# EAGLE design Main_board_TH (EAGLE 8.0.1)
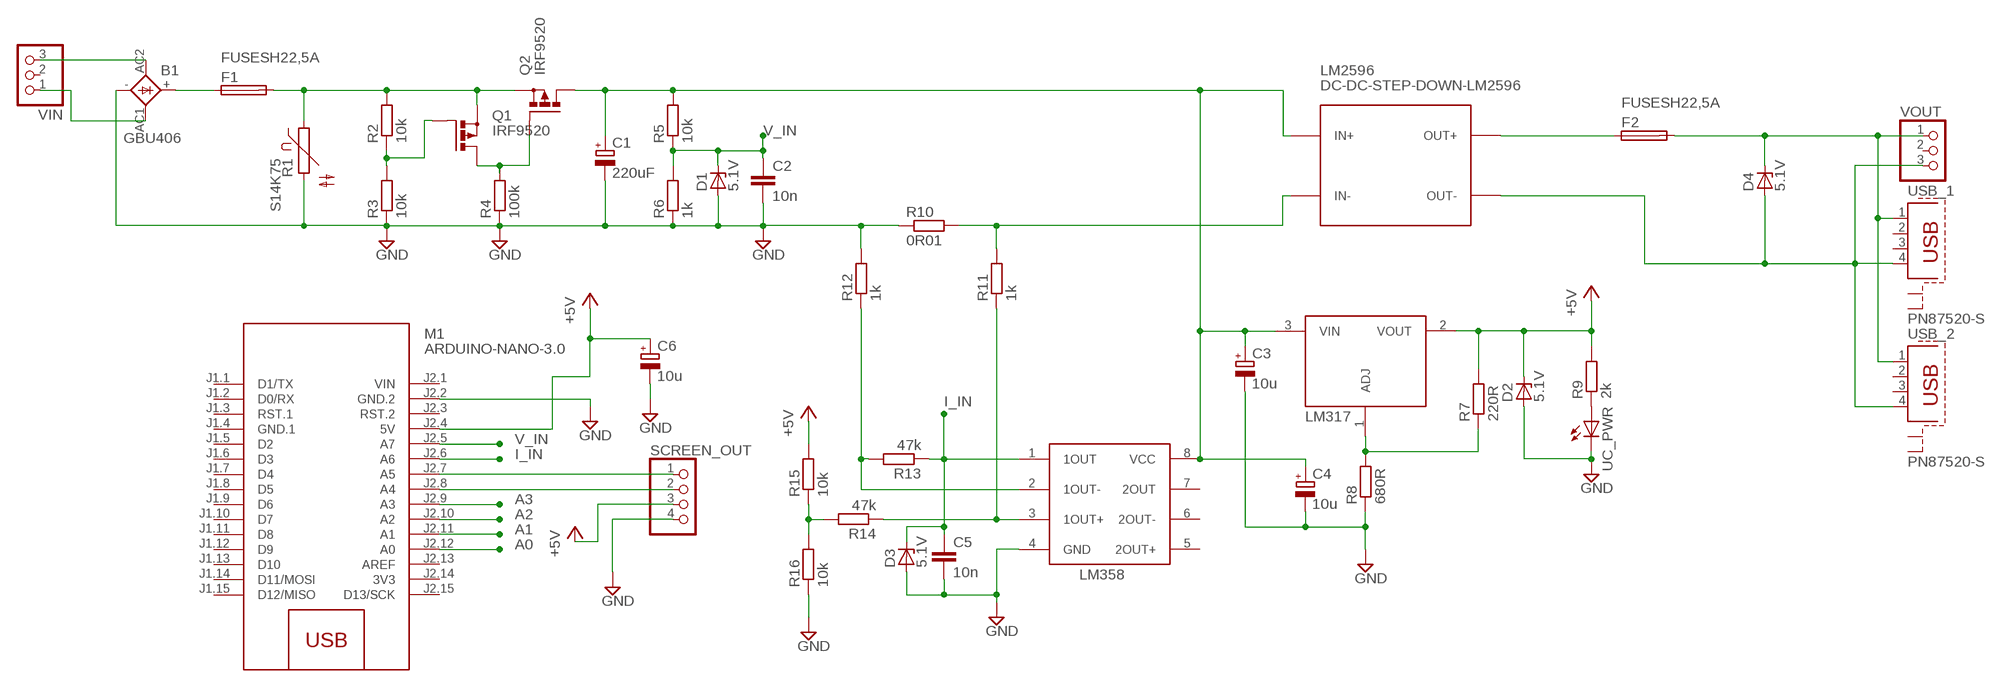
[diagram p0: schematic, sheet 1]

## Parts
B1  GBU406  GBU4  [GBU4S]
C1  220uF  CPOL-EUE3.5-10  [E3,5-10]
C2  10n  C-EU050-024X044  [C050-024X044]
C3  10u  CPOL-EUE2.5-7  [E2,5-7]
C4  10u  CPOL-EUE2.5-7  [E2,5-7]
C5  10n  C-EU050-024X044  [C050-024X044]
C6  10u  CPOL-EUE2.5-7  [E2,5-7]
D1  5.1V  ZPD  [DO35Z10]
D2  5.1V  ZPD  [DO35Z10]
D3  5.1V  ZPD  [DO35Z10]
D4  5.1V  ZPD  [DO35Z10]
F1  FUSESH22,5A  [SH22,5A]
F2  FUSESH22,5A  [SH22,5A]
LM317  LM317  [TO220BV]
LM358  LM358  [DIL08]
LM2596  DC-DC-STEP-DOWN-LM2596  [DC-DC-STEP-DOWN-LM2596]
M1  ARDUINO-NANO-3.0  [ARDUINO-NANO-3.0]
Q1  IRF9520  PMOSFET_PTO220BV  [TO220BV]
Q2  IRF9520  PMOSFET_PTO220BV  [TO220BV]
R1  S14K75  S14K17  [S14K17]
R2  10k  R-EU_0207/10  [0207/10]
R3  10k  R-EU_0207/10  [0207/10]
R4  100k  R-EU_0207/10  [0207/10]
R5  10k  R-EU_0207/10  [0207/10]
R6  1k  R-EU_0207/10  [0207/10]
R7  220R  R-EU_0207/10  [0207/10]
R8  680R  R-EU_0207/10  [0207/10]
R9  2k  R-EU_0207/10  [0207/10]
R10  0R01  R-EU_0207/15  [0207/15]
R11  1k  R-EU_0207/10  [0207/10]
R12  1k  R-EU_0207/10  [0207/10]
R13  47k  R-EU_0207/10  [0207/10]
R14  47k  R-EU_0207/10  [0207/10]
R15  10k  R-EU_0207/10  [0207/10]
R16  10k  R-EU_0207/10  [0207/10]
SCREEN_OUT  PINHD-1X4  [1X04]
UC_PWR  LED3MM  [LED3MM]
USB_1  PN87520-S  [PN87520-S]
USB_2  PN87520-S  [PN87520-S]
VIN  PINHD-1X3  [1X03]
VOUT  PINHD-1X3  [1X03]

## Nets
+5V: C6.+ D2.C LM317.2(VOUT) M1.J2.4(5V) R7.2 R9.2 R15.2 SCREEN_OUT.3
A0: M1.J2.12(A0)
A1: M1.J2.11(A1)
A2: M1.J2.10(A2)
A3: M1.J2.9(A3)
A4: M1.J2.8(A4) SCREEN_OUT.2
A5: M1.J2.7(A5) SCREEN_OUT.1
GND: B1.- C1.- C2.2 C3.- C4.- C5.2 C6.- D1.A D2.A D3.A LM358.4(GND) M1.J2.2(GND.2) R1.2 R3.1 R4.1 R6.1 R8.1 R10.1 R12.2 R16.1 SCREEN_OUT.4 UC_PWR.K(C)
I_IN: C5.1 D3.C LM358.1(1OUT) M1.J2.6(A6) R13.1
N$1: B1.+ F1.1
N$2: R9.1 UC_PWR.A
N$3: Q1.1(G) R2.1 R3.2
N$4: LM2596.IN- R10.2 R11.2
N$5: LM358.3(1OUT+) R11.1 R14.1
N$6: LM358.2(1OUT-) R12.1 R13.2
N$7: B1.AC1(AC2) VIN.1
N$8: R14.2 R15.1 R16.2
N$9: B1.AC2(AC1) VIN.3
N$10: D4.A LM2596.OUT- USB_1.4 USB_2.4 VOUT.3
N$23: LM317.1(ADJ) R7.1 R8.2
Q2_GATE: Q1.2(D) Q2.1(G) R4.2
V_IN: C2.1 D1.C M1.J2.5(A7) R5.1 R6.2
VIN_PROTECTED: C1.+ C3.+ C4.+ LM317.3(VIN) LM358.8(VCC) LM2596.IN+ Q2.2(D) R5.2
VIN_UNPROTECTED: F1.2 Q1.3(S) Q2.3(S) R1.1 R2.2
VOUT_FINAL: D4.C F2.2 USB_1.1 USB_2.1 VOUT.1
VOUT_PREFUSE: F2.1 LM2596.OUT+
Unconnected: LM358.5(2OUT+) LM358.6(2OUT-) LM358.7(2OUT) M1.J1.1(D1/TX) M1.J1.2(D0/RX) M1.J1.3(RST.1) M1.J1.5(D2) M1.J1.6(D3) M1.J1.7(D4) M1.J1.8(D5) M1.J1.9(D6) M1.J1.10(D7) M1.J1.11(D8) M1.J1.12(D9) M1.J1.13(D10) M1.J1.14(D11/MOSI) M1.J1.15(D12/MISO) M1.J2.3(RST.2) M1.J2.13(AREF) M1.J2.15(D13/SCK) USB_1.2 USB_1.3 USB_1.S1 USB_1.S2 USB_2.2 USB_2.3 USB_2.S1 USB_2.S2 VIN.2 VOUT.2

## Power pins joined to a net without a drawn wire
3V3: M1.J2.14(3V3)
GND.1: M1.J1.4(GND.1)
VIN: M1.J2.1(VIN)

## Library data of the parts
B1 = rectifier:GBU4: GENERAL INSTRUMENT RECTIFIER
C1 C3 C4 C6 = resistor:CPOL-EU: POLARIZED CAPACITOR, European symbol
C2 C5 = resistor:C-EU: CAPACITOR, European symbol
D1-D4 = diode:ZPD: Z DIODE 500 mW
F1 F2 = fuse:FUSE: Fuse; OC_FARNELL: unknown; OC_NEWARK: unknown
LM317 = Samson:LM317
LM358 = Samson:LM358
LM2596 = diy-modules:DC-DC-STEP-DOWN-LM2596: DC/DC Step-Down Regulator based on LM2596-ADJ chip LM2596 datasheet available here: http://www.ti.com/lit/ds/symlink/lm2596.pdf Click here to find device on ebay.com <http://www.ebay.com/sch/lm2596+power+regulator>
M1 = diy-modules:ARDUINO-NANO-3.0: Arduino Nano 3.0 and compatible devices More details available here: https://www.arduino.cc/en/Main/ArduinoBoardNano Click here to find device on ebay.com <http://www.ebay.com/sch/arduino+nano>
Q1 Q2 = Samson:PMOSFET_P: Power MOSFET P-Channel
R1 = varistor:S14K17: VARISTOR
R2-R16 = resistor:R-EU_: RESISTOR, European symbol
SCREEN_OUT = pinhead:PINHD-1X4: PIN HEADER
UC_PWR = led:LED: LED OSRAM: - CHIPLED LG R971, LG N971, LY N971, LG Q971, LY Q971, LO R971, LY R971 LH N974, LH R974 LS Q976, LO Q976, LY Q976 LO Q996 - Hyper CHIPLED LW Q18S LB Q993, LB Q99A, LB R99A - SideLED LS A670, LO A670, LY A670, LG A670, LP A670 LB A673, LV A673, LT A673, LW A673 LH A674 LY A675 LS A676, LA A676, LO A676, LY A676, LW A676 LS A679, LY A679, LG A679 - Hyper Micro SIDELED® LS Y876, LA Y876, LO Y876, LY Y876 LT Y87S - SmartLED LW L88C, LW L88S LB L89C, LB L89S, LG L890 LS L89K, LO L89K, LY L89K LS L896, LA L896, LO L896, LY L896 - TOPLED LS T670, LO T670, LY T670, LG T670, LP T670 LSG T670, LSP T670, LSY T670, LOP T670, LYG T670 LG T671, LOG T671, LSG T671 LB T673, LV T673, LT T673, LW T673 LH T674 LS T676, LA T676, LO T676, LY T676, LB T676, LH T676, LSB T676, LW T676 LB T67C, LV T67C, LT T67C, LS T67K, LO T67K, LY T67K, LW E67C LS E67B, LA E67B, LO E67B, LY E67B, LB E67C, LV E67C, LT E67C LW T67C LS T679, LY T679, LG T679 LS T770, LO T770, LY T770, LG T770, LP T770 LB T773, LV T773, LT T773, LW T773 LH T774 LS E675, LA E675, LY E675, LS T675 LS T776, LA T776, LO T776, LY T776, LB T776 LHGB T686 LT T68C, LB T68C - Hyper Mini TOPLED® LB M676 - Mini TOPLED Santana® LG M470 LS M47K, LO M47K, LY M47K Source: http://www.osram.convergy.de LUXEON: - LUMILED® LXK2-PW12-R00, LXK2-PW12-S00, LXK2-PW14-U00, LXK2-PW14-V00 LXK2-PM12-R00, LXK2-PM12-S00, LXK2-PM14-U00 LXK2-PE12-Q00, LXK2-PE12-R00, LXK2-PE12-S00, LXK2-PE14-T00, LXK2-PE14-U00 LXK2-PB12-K00, LXK2-PB12-L00, LXK2-PB12-M00, LXK2-PB14-N00, LXK2-PB14-P00, LXK2-PB14-Q00 LXK2-PR12-L00, LXK2-PR12-M00, LXK2-PR14-Q00, LXK2-PR14-R00 LXK2-PD12-Q00, LXK2-PD12-R00, LXK2-PD12-S00 LXK2-PH12-R00, LXK2-PH12-S00 LXK2-PL12-P00, LXK2-PL12-Q00, LXK2-PL12-R00 Source: www.luxeon.com KINGBRIGHT: KA-3528ASYC Source: www.kingbright.com
USB_1 USB_2 = con-berg:PN87520-S; OC_FARNELL: unknown; OC_NEWARK: unknown
VIN VOUT = pinhead:PINHD-1X3: PIN HEADER

## Module BB1
Ports: 

### Library data of the parts

## Board
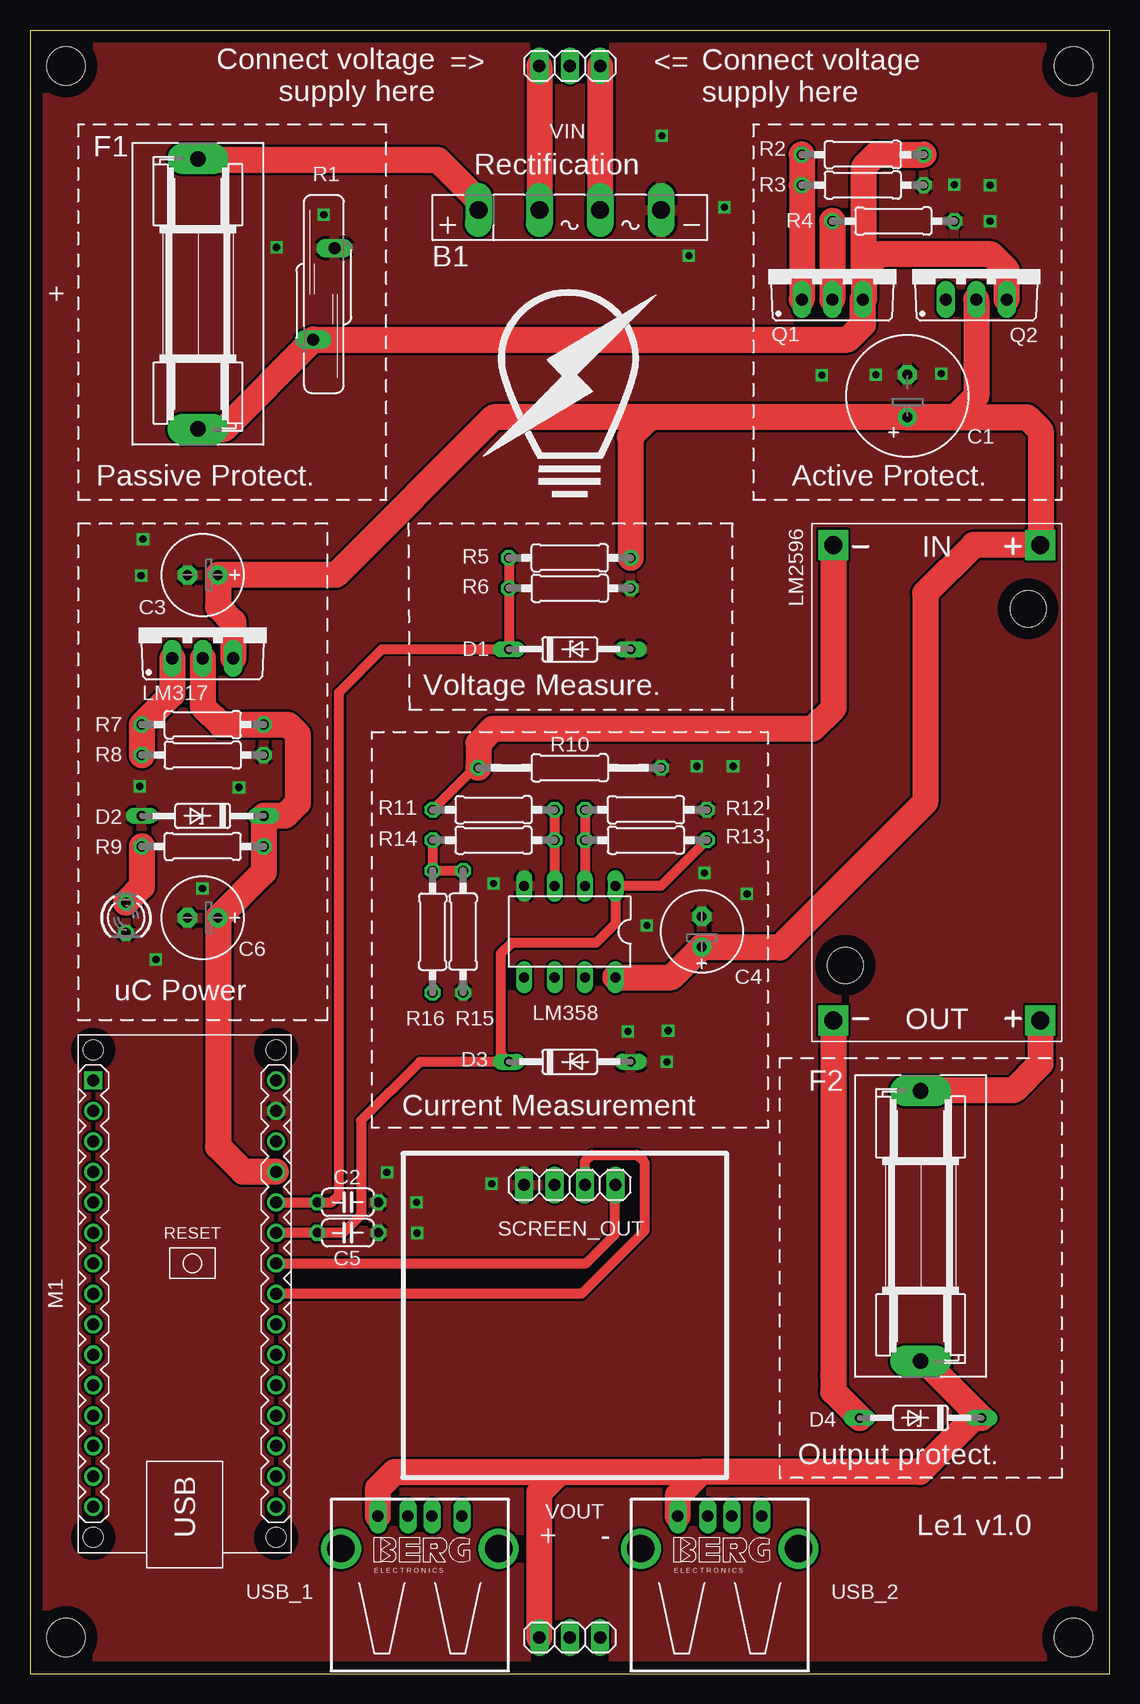
[diagram p1: board, top side]
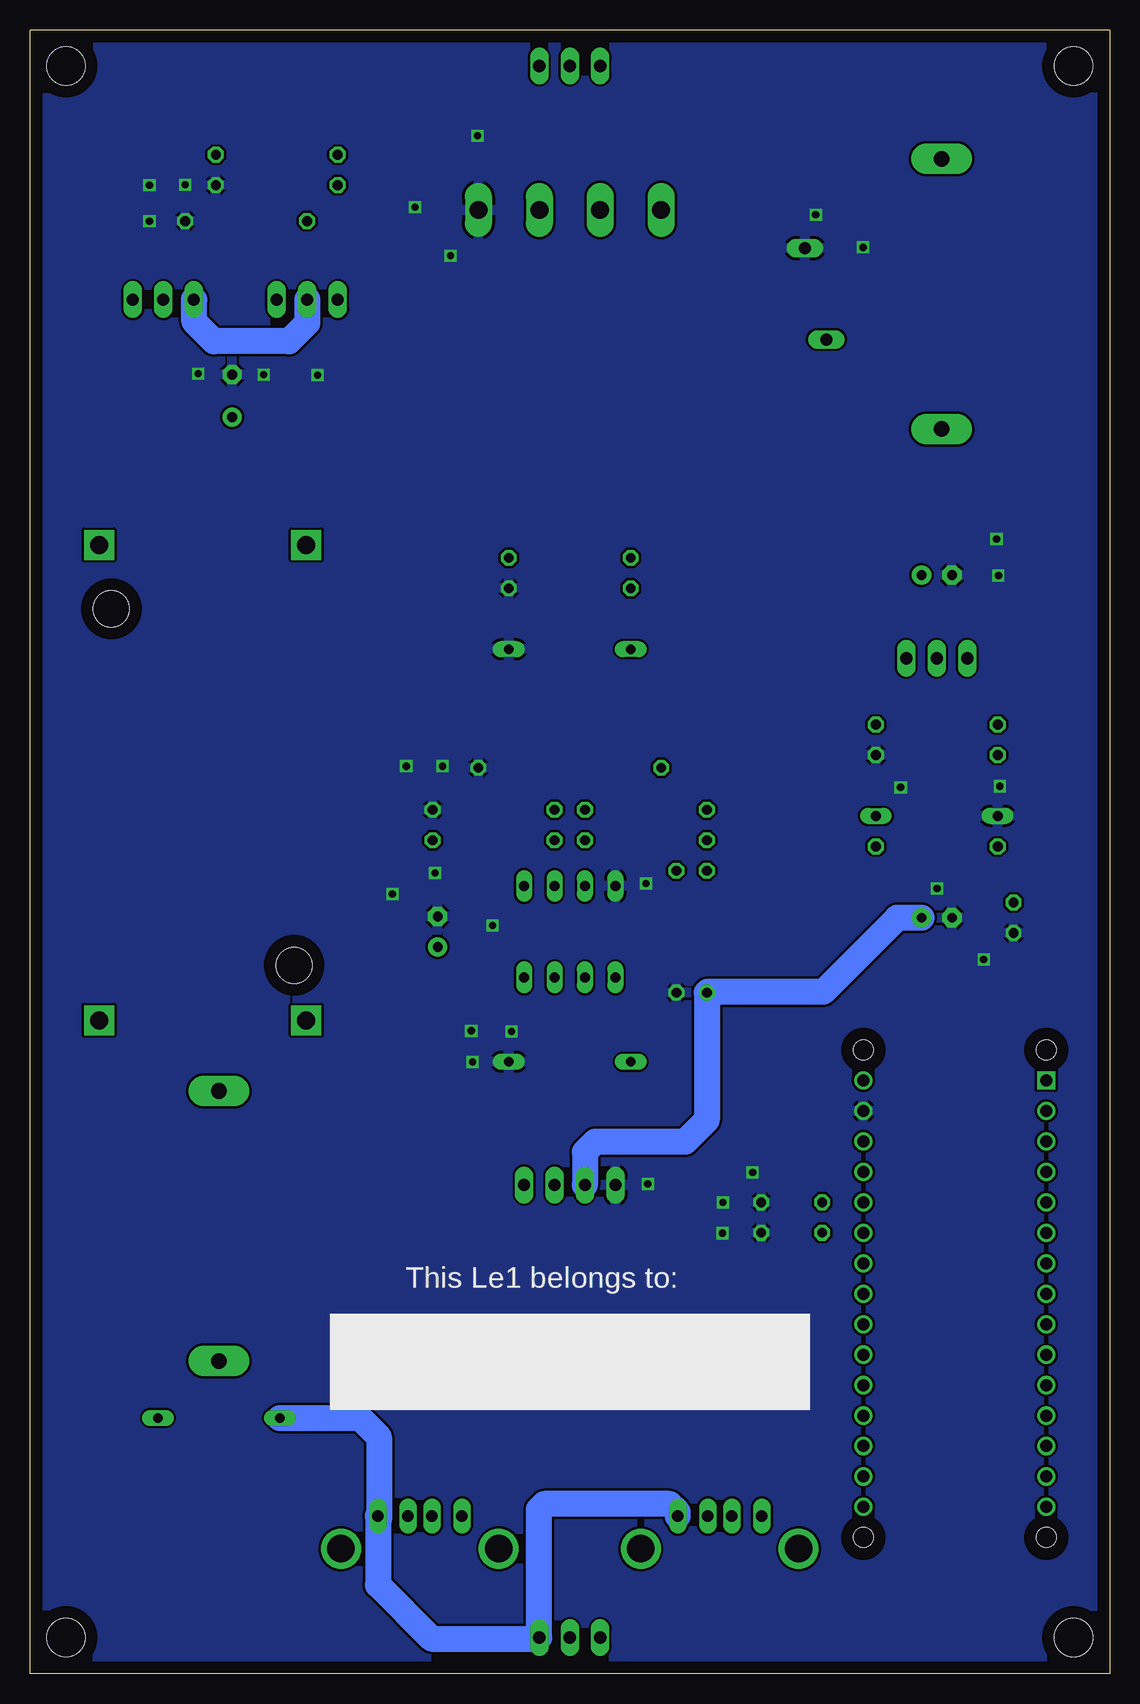
[diagram p2: board, bottom side, seen from below]

Size 90 x 137 mm. Coordinates in mm from the lower left corner, seen from the top.
Outline: 0,137 0,0 90,0 90,137 0,137
Copper layers (1*16): Top 0.035mm / dielectric 1.5mm / Bottom 0.035mm
Design rules "default *": minimum track width 10mil, minimum drill 20mil, track to track 8mil, track to pad 8mil, pad to pad 8mil, via to via 8mil, smd to smd 8mil, copper to edge 40mil, drill to drill 8mil, minimum pad ring 10mil, minimum via ring 8mil, stop-mask expansion 4mil, vias tented up to drill 0mil, thermal gap 10mil
Holes 3.2 mm at 87,134 87,3 3,3 3,134

### Footprints (pad centres in the part's own frame; a part is rotated, then mirrored left to right if it is on the bottom)
GBU4S = drill 1.499 long: + 7.62,0; - -7.62,0; AC1 2.54,0; AC2 -2.54,0
E3,5-10 = drill 0.813 pad 1.6: + -1.778,0 | drill 0.813 pad 1.6 octagon: - 1.778,0
C050-024X044 = drill 0.813 octagon: 1 -2.54,0; 2 2.54,0
E2,5-7 = drill 0.813 pad 1.6: + -1.27,0 | drill 0.813 pad 1.6 octagon: - 1.27,0
DO35Z10 = drill 0.813 long: A 5.08,0; C -5.08,0
SH22,5A = drill 1.321 pad 2.54 long: 1 -11.252,0; 2 11.252,0
TO220BV = drill 1.016 long: 1 -2.54,-2.54; 2 0,-2.54; 3 2.54,-2.54
DIL08 = drill 0.813 long: 1 -3.81,-3.81; 2 -1.27,-3.81; 3 1.27,-3.81; 4 3.81,-3.81; 5 3.81,3.81; 6 1.27,3.81; 7 -1.27,3.81; 8 -3.81,3.81
DC-DC-STEP-DOWN-LM2596 = drill 1.5 pad 2.5 square: IN+ -19.812,8.636; IN- -19.812,-8.636; OUT+ 19.812,8.636; OUT- 19.812,-8.636 | hole 3: -14.478,7.62; 15.24,-7.62
ARDUINO-NANO-3.0 = drill 1 square: J1.1 17.78,7.62 | drill 1: J1.2 15.24,7.62; J1.3 12.7,7.62; J1.4 10.16,7.62; J1.5 7.62,7.62; J1.6 5.08,7.62; J1.7 2.54,7.62; J1.8 0,7.62; J1.9 -2.54,7.62; J1.10 -5.08,7.62; J1.11 -7.62,7.62; J1.12 -10.16,7.62; J1.13 -12.7,7.62; J1.14 -15.24,7.62; J1.15 -17.78,7.62; J2.1 17.78,-7.62; J2.2 15.24,-7.62; J2.3 12.7,-7.62; J2.4 10.16,-7.62; J2.5 7.62,-7.62; J2.6 5.08,-7.62; J2.7 2.54,-7.62; J2.8 0,-7.62; J2.9 -2.54,-7.62; J2.10 -5.08,-7.62; J2.11 -7.62,-7.62; J2.12 -10.16,-7.62; J2.13 -12.7,-7.62; J2.14 -15.24,-7.62; J2.15 -17.78,-7.62 | hole 1.651: -20.32,7.62; -20.32,-7.62; 20.32,-7.62; 20.32,7.62
S14K17 = drill 1.016 long: 1 -0.889,-3.81; 2 0.889,3.81
0207/10 = drill 0.813 octagon: 1 -5.08,0; 2 5.08,0
0207/15 = drill 0.813 octagon: 1 -7.62,0; 2 7.62,0
1X04 = drill 1.016 long: 1 -3.81,0; 2 -1.27,0; 3 1.27,0; 4 3.81,0
LED3MM = drill 0.813 octagon: A -1.27,0; K 1.27,0
PN87520-S = drill 0.95 long: 1 -3.5,2.71; 2 -1,2.71; 3 1,2.71; 4 3.5,2.71 | drill 2.3 pad 2.9: S1 -6.57,0; S2 6.57,0
1X03 = drill 1.016 long: 1 -2.54,0; 2 0,0; 3 2.54,0

### Placement (x,y rotation side)
B1  45,122 180 top
C1  73.15,106.5 90 top
C2  26.5,39.28 0 top
C3  14.4,91.57 180 top
C4  56.01,61.84 90 top
C5  26.5,36.74 0 top
C6  14.4,63 180 top
D1  45,85.38 0 top
D2  14.4,71.48 180 top
D3  45,51 0 top
D4  74.25,21.3 180 top
F1  14,115 270 top
F2  74.25,37.3 270 top
LM317  14.4,87.17 0 top
LM358  45,61.84 180 top
LM2596  75.6,74.27 270 top
M1  12.9,31.66 90 top
Q1  66.89,117.07 0 top
Q2  78.89,117.07 0 top
R1  24.5,115 0 top
R2  69.43,126.61 0 top
R3  69.43,124.07 180 top
R4  71.98,121.07 180 top
R5  45,93 0 top
R6  45,90.46 180 top
R7  14.4,79.1 0 top
R8  14.4,76.56 180 top
R9  14.4,68.94 0 top
R10  45,75.5 180 top
R11  38.65,72 180 top
R12  51.35,72 0 top
R13  51.35,69.46 180 top
R14  38.65,69.46 180 top
R15  33.57,61.84 270 top
R16  36.11,61.84 90 top
SCREEN_OUT  45,40.72 180 top
UC_PWR  8,63 270 top
USB_1  32.5,10.4 0 top
USB_2  57.5,10.4 0 top
VIN  45,134 0 top
VOUT  45,3 0 top

### Tracks (layer width: path | path; a pad name or v marks a point on that pad's centre or on a via)
+5V
  Top 2.184: LM317.2 14.4,80.61 15.92,79.09 R7.2 21.52,79.1 22.32,78.3 22.32,72.55 21.25,71.48 D2.C R9.2 19.48,66.81 C6.+ 15.67,43.93 17.76,41.84 20.52,41.84 M1.J2.4
  Bottom 2.184: C6.+ 17.69,63 23.87,56.82 33.51,56.82 R15.2 33.57,46.14 35.39,44.32 42.89,44.32 43.75,43.46 43.75,40.74 SCREEN_OUT.3
A4
  Top 0.813: SCREEN_OUT.2 46.27,42.68 46.84,43.25 50.59,43.25 51.21,42.63 51.21,36.89 45.98,31.66 M1.J2.8
A5
  Top 0.813: M1.J2.7 46.36,34.2 48.76,36.6 48.76,40.67 SCREEN_OUT.1
GND  (via drill 0.6)
  other vias: 57.9,122.23 80.04,124.06 80.04,121.07 32.23,39.27 29.76,41.78 52.68,128.19 77.07,124.11 32.27,36.71 38.5,40.8 20.55,118.88 54.95,118.18 24.5,121.6 53.12,50.99 49.85,53.53 53.21,53.58 10.5,59.53 14.38,65.43 59.79,64.97 56.23,66.72 51.43,62.35 38.64,65.85 9.26,91.52 9.42,94.55 70.53,108.27 66.02,108.23 75.99,108.36 55.62,75.63 58.63,75.63 9.15,73.96 17.42,73.87
  pour Bottom: 90.83,137.52 91.25,-2.02 -1.44,-2.02 -1.86,6.38 -2.32,6.38 -2.32,137.74 0.52,137.74
  pour Top: 90.77,137.92 91.4,-2.26 -1.84,-2.26 -2.47,137.93
I_IN
  Top 0.813: R13.1 52.62,65.65 LM358.1 48.81,62.54 47.18,60.91 40.14,60.91 39.24,60.01 39.24,51.68 D3.C 32.5,51 27.59,46.09 27.59,38.22 26.09,36.72 23.98,36.72 C5.1 | C5.1 24.67,36.73 | C5.1 M1.J2.6
N$1
  Top 2.184: B1.+ 37.38,122.79 34.01,126.16 13.59,126.16 F1.1
N$2
  Top 2.184: R9.1 9.32,65.59 UC_PWR.A
N$3
  Top 2.184: R2.1 R3.2 Q1.1
N$4
  Top 0.813: R10.2 37.07,75.5 R11.2
  Top 2.184: R10.2 37.38,77.54 38.6,78.76 65.26,78.76 67,80.5 67,94.05 LM2596.IN-
N$5
  Top 0.813: R11.1 R14.1 LM358.3
N$6
  Top 0.813: LM358.2 R13.2 R12.1
N$7
  Top 2.184: VIN.1 B1.AC1
N$8
  Top 0.813: R14.2 R15.1 R16.2
N$9
  Top 2.184: VIN.3 B1.AC2
N$10
  Top 2.184: LM2596.OUT- 66.96,24.86 | 66.98,24.84 66.96,24.86 | 66.96,24.86 66.96,23.51 D4.A
  Bottom 2.184: USB_1.4 36,13.46 36.67,14.13 47.11,14.13 47.59,13.65 47.59,3.05 VOUT.3 47.64,2.9 56.52,2.9 61,7.38 USB_2.4 60.9,12.81 60.9,19.72 62.48,21.3 D4.A
N$23
  Top 2.184: LM317.1 11.86,81.64 R7.1 R8.2
Q2_GATE
  Top 2.184: R4.2 Q1.2
  Bottom 2.184: Q1.2 66.89,112.57 68.4,111.06 74.67,111.06 76.31,112.7 76.31,114.49 Q2.1
V_IN
  Top 0.813: R5.1 R6.2 D1.C 29.35,85.38 25.75,81.78 25.75,39.87 25.16,39.28 C2.1 M1.J2.5
VIN_PROTECTED
  Top 2.184: Q2.2 78.89,106.47 77.14,104.72 C1.+ | C1.+ 83.14,104.72 84.26,103.6 84.26,94.11 LM2596.IN+ 78.67,94.08 74.64,90.05 74.64,72.63 62.52,60.51 56.07,60.51 C4.+ 53.47,58.03 LM358.8 | C1.+ 51.67,104.72 | 50.05,103.1 51.67,104.72 | 50.05,103.1 50.05,93.03 R5.2 | 50,103.05 50.05,103.1 | LM317.3 16.94,87.66 15.67,88.93 C3.+ 25.5,91.57 38.65,104.72 51.67,104.72
VIN_UNPROTECTED
  Top 2.184: R2.2 70.54,126.61 69.53,125.6 69.53,117.04 | 69.53,117.04 69.53,114.63 Q1.3 69.44,112.45 68.18,111.19 R1.1 16.17,103.75 F1.2 | Q2.3 81.43,117.02 80.14,118.31 70.8,118.31 69.53,117.04
VOUT_FINAL
  Top 2.184: 44.17,16.8 55.97,16.8 | 44.17,16.8 30.38,16.8 29,15.42 USB_1.1 | USB_2.1 54,14.83 55.97,16.8 | VOUT.1 42.46,15.09 44.17,16.8 | 55.97,16.8 74.18,16.8 78.68,21.3 D4.C 74.58,26.05 F2.2
VOUT_PREFUSE
  Top 2.184: LM2596.OUT+ 84.24,50.84 82.02,48.62 73.06,48.62 F2.1

### Text on the board
tPlace: Le1 v1.0
bPlace: This Le1 belongs to:
tNames: Connect voltage / supply here | => | <= | Connect voltage / supply here | Rectification | + | Passive Protect. | Active Protect. | Voltage Measure. | uC Power | Current Measurement | Output protect. | + | -